# Altium project Solar_Panel_Sides.PrjPcb
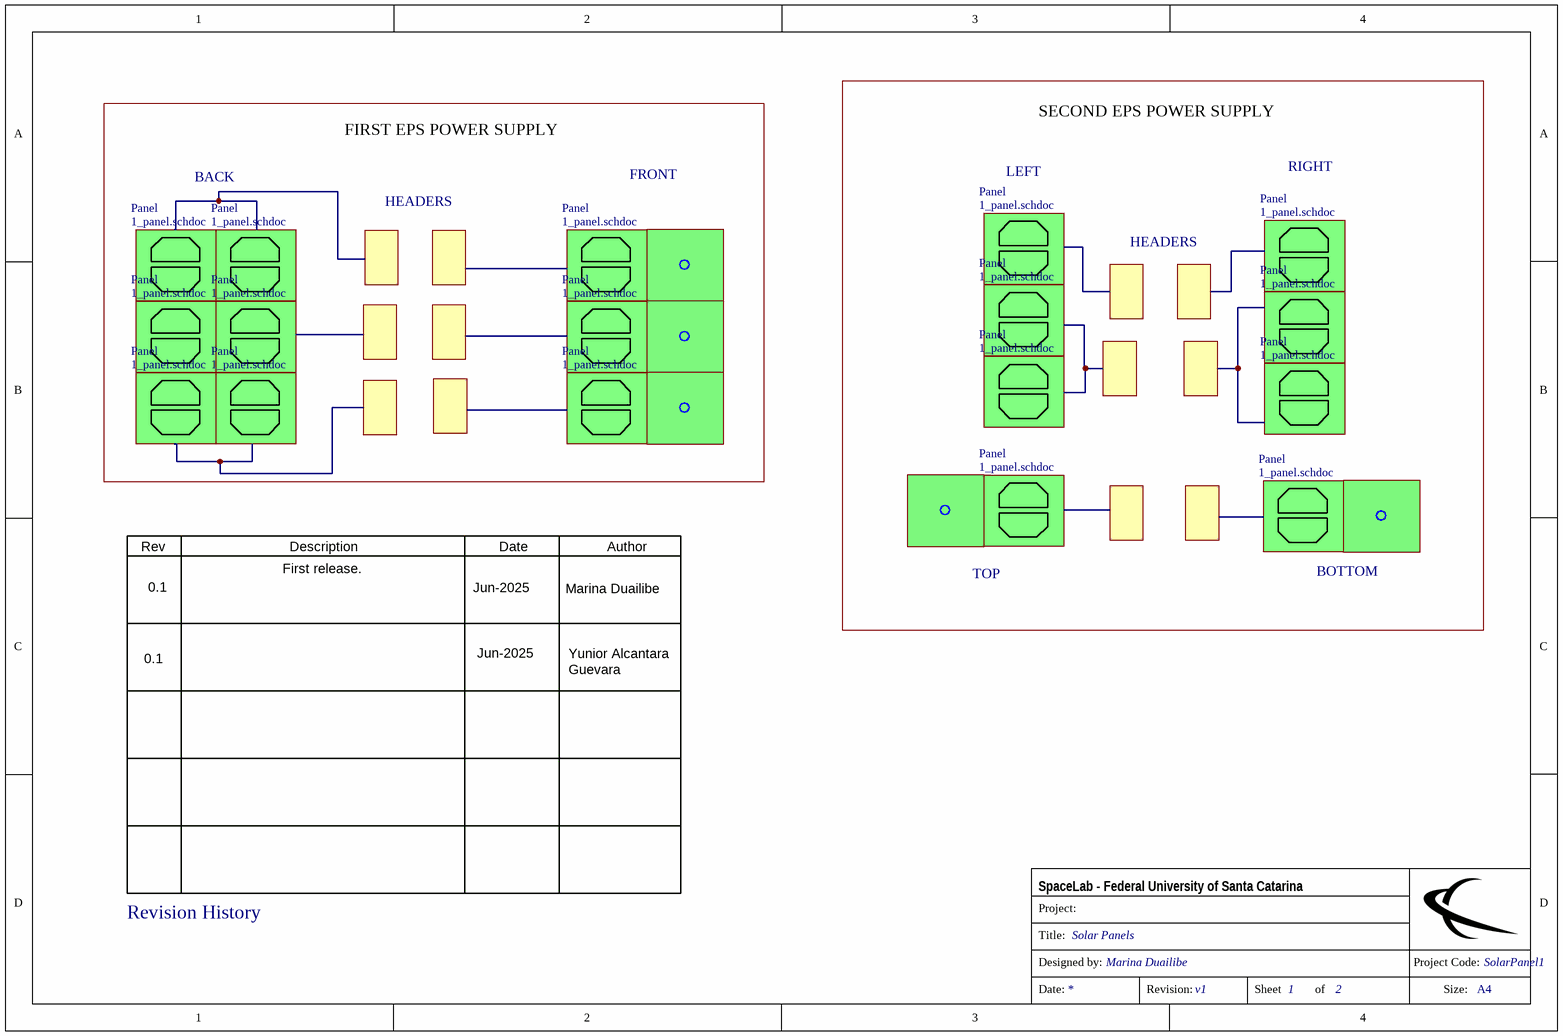
[diagram p0: 1_Architecture.schdoc]
DesignedBy: Marina Duailibe; ProjectCode: SolarPanel1; Revision: v1
2 sheets, 153 parts. Net scope: global (net labels, ports and power ports of the same name join across sheets).
Board file: PCB1.PcbDoc
Sheets:
  1_Architecture.schdoc
    Panel = 1_panel.schdoc
    Panel = 1_panel.schdoc
    Panel = 1_panel.schdoc
    Panel = 1_panel.schdoc
    Panel = 1_panel.schdoc
    Panel = 1_panel.schdoc
    Panel = 1_panel.schdoc
    Panel = 1_panel.schdoc
    Panel = 1_panel.schdoc
    Panel = 1_panel.schdoc
    Panel = 1_panel.schdoc
    Panel = 1_panel.schdoc
    Panel = 1_panel.schdoc
    Panel = 1_panel.schdoc
    Panel = 1_panel.schdoc
    Panel = 1_panel.schdoc
    Panel = 1_panel.schdoc

## Sheet 1_Architecture.schdoc: Solar Panels
size A4; Engineer: Eng_2_ALT; SheetNumber: 1; SheetTotal: 2; Designed by: Marina Duailibe; Version: v0.1; ProjectCode: SolarPanel1

### Sub-sheets
Panel = 1_panel.schdoc: no entries
Panel = 1_panel.schdoc: no entries
Panel = 1_panel.schdoc: no entries
Panel = 1_panel.schdoc: no entries
Panel = 1_panel.schdoc: no entries
Panel = 1_panel.schdoc: no entries
Panel = 1_panel.schdoc: no entries
Panel = 1_panel.schdoc: no entries
Panel = 1_panel.schdoc: no entries
Panel = 1_panel.schdoc: no entries
Panel = 1_panel.schdoc: no entries
Panel = 1_panel.schdoc: no entries
Panel = 1_panel.schdoc: no entries
Panel = 1_panel.schdoc: no entries
Panel = 1_panel.schdoc: no entries
Panel = 1_panel.schdoc: no entries
Panel = 1_panel.schdoc: no entries

### Notes on the sheet
- BACK
- FIRST EPS POWER SUPPLY
- FRONT
- LEFT
- SECOND EPS POWER SUPPLY
- RIGHT
- HEADERS
- Rev
- Description
- Date
- Author
- TOP
- BOTTOM
- 0.1
- First release.
- Jun-2025
- Marina Duailibe
- Yunior Alcantara
- Guevara
- Revision History
- Project:
- SpaceLab - Federal University of Santa Catarina
- Title:
- Designed by:
- Project Code:
- Date:
- Revision:
- Sheet
- of
- Size:
- A4

## Sheet 1_panel.schdoc: Solar Cells
size A4; Engineer: Eng_2_ALT; SheetNumber: 2; SheetTotal: 2; Designed by: Marina Duailibe; Version: v0.1; ProjectCode: SolarPanel1
Used 17 times, as channels Panel, Panel, Panel, Panel, Panel, Panel, Panel, Panel, Panel, Panel, Panel, Panel, Panel, Panel, Panel, Panel, Panel. Parts and nets are listed once, with the designators drawn on the sheet.
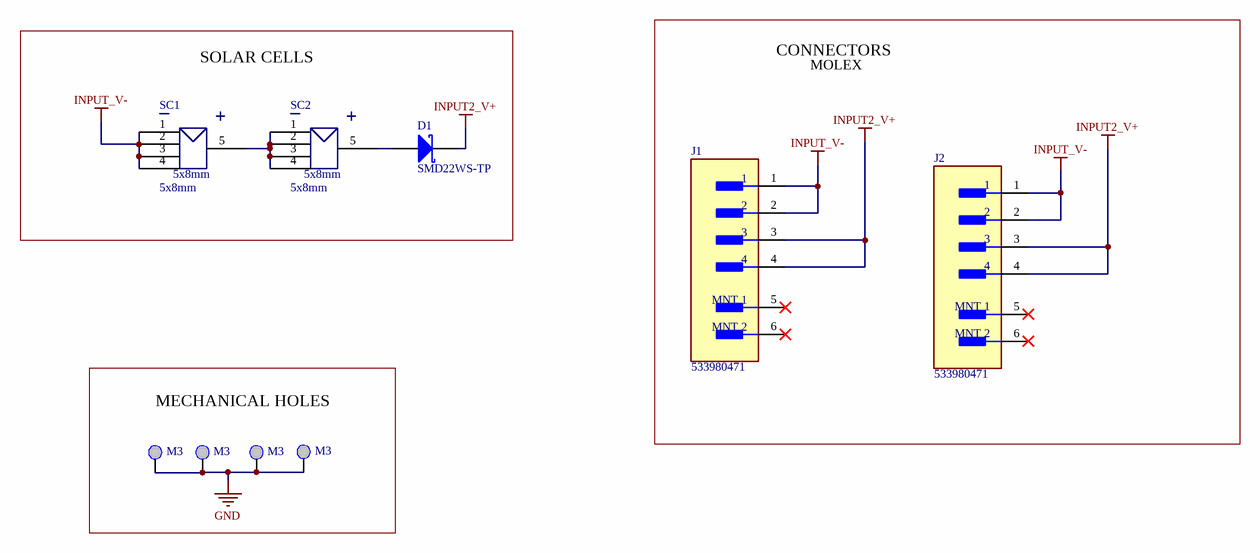
[diagram p1: 1_panel.schdoc]

### Parts
D1  SMD22WS-TP  [SOD323F]
J1  533980471  [FP-533980471-MFG]
J2  533980471  [FP-533980471-MFG]
MEC1  M3  [HOLE6x6mm]  (no BOM)
MEC2  M3  [HOLE6x6mm]  (no BOM)
MEC3  M3  [HOLE6x6mm]  (no BOM)
MEC4  M3  [HOLE6x6mm]  (no BOM)
SC1  5x8mm  [SOLAR_CELL]
SC2  5x8mm  [SOLAR_CELL]

### Blocks framed on the sheet
SOLAR CELLS: D1 SC1 SC2
CONNECTORS: J1 J2
MECHANICAL HOLES: MEC1-MEC4

### Nets
GND: MEC1.0 MEC2.0 MEC3.0 MEC4.0
INPUT2_V+: D1.1(K) J1.3 J1.4 J2.3 J2.4
INPUT_V-: J1.1 J1.2 J2.1 J2.2 SC1.1(V+) SC1.2(V-) SC1.3 SC1.4
NetD1_2: D1.2(A) SC2.5
NetSC1_5: SC1.5 SC2.1(V+) SC2.2(V-) SC2.3 SC2.4

Not connected (* = marked no-connect by the designer): J1 5(MNT_1)* 6(MNT_2)*; J2 5(MNT_1)* 6(MNT_2)*

### Channels
Panel: no parts or ports
Panel: designators end in _Panel#1
Panel: designators end in _Panel#2
Panel: designators end in _Panel#3
Panel: designators end in _Panel#4
Panel: designators end in _Panel#5
Panel: designators end in _Panel#6
Panel: designators end in _Panel#7
Panel: designators end in _Panel#8
Panel: designators end in _Panel#9
Panel: designators end in _Panel#10
Panel: designators end in _Panel#11
Panel: designators end in _Panel#12
Panel: designators end in _Panel#13
Panel: designators end in _Panel#14
Panel: designators end in _Panel#15
Panel: designators end in _Panel#16

### Notes on the sheet
- MOLEX
- Project:
- SpaceLab - Federal University of Santa Catarina
- Title:
- Designed by:
- Project Code:
- Date:
- Revision:
- Sheet
- of
- Size:
- A4
- (in symbol SOLAR CELL) _; +

### Library data of the parts
D1 = DIODE_SCHOTTKY_20V_2A_SMD22WS-TP: Diode Schottky 20 V 2A Surface Mount SOD-323; Partnumber: SMD22WS-TP
J1 J2 = CMP-04776-000105-1: CONN HEADER SMD 4POS 1.25MM; Manufacturer: Molex; Conn Gender: Male; Conn Orientation: Vertical; Standoff Height: 0.05mm; Number Of Contacts: 4; Current Rating: 1A; Voltage Rating: 125V; Package: 0; ComponentLink2Description: Datasheet; ComponentLink2URL: https://www.molex.com/pdm_docs/ps/PS-51021-024-001.pdf; Ambient Temperature Range Low: -40°C; Category: Conn; Automotive: No; Number Of Rows: 1; Device Class L3: unset; Ambient Temperature Range High: +105°C; Height: 5.1mm; Lead Free: Yes; Pitch: 1.25mm; Contact Material: Tin; Footprint Url: https://www.molex.com/pdm_docs/sd/533980471_sd.pdf; Octopart: https://octopart.com/53398-0471-molex-655296; Temperature Range Low: -40°C; Device Class L2: Headers and Wire Housings; Temperature: -40°C to +105°C; Digikey Description: CONN HEADER SMD 4POS 1.25MM; RoHS: TRUE; Manufacturer Part Number: 533980471; Device Class L1: Connectors; Temperature Range High: +105°C
MEC1-MEC4 = M3 hole
SC1 SC2 = SOLAR CELL: Manufacturer: Yim Space; PDM Number: SC-3GA-3

## Nets that join several sheets
GND: Panel (MEC1.0 MEC2.0 MEC3.0 MEC4.0), Panel (MEC1_Panel#1.0 MEC2_Panel#1.0 MEC3_Panel#1.0 MEC4_Panel#1.0), Panel (MEC1_Panel#2.0 MEC2_Panel#2.0 MEC3_Panel#2.0 MEC4_Panel#2.0), Panel (MEC1_Panel#3.0 MEC2_Panel#3.0 MEC3_Panel#3.0 MEC4_Panel#3.0), Panel (MEC1_Panel#4.0 MEC2_Panel#4.0 MEC3_Panel#4.0 MEC4_Panel#4.0), Panel (MEC1_Panel#5.0 MEC2_Panel#5.0 MEC3_Panel#5.0 MEC4_Panel#5.0), Panel (MEC1_Panel#6.0 MEC2_Panel#6.0 MEC3_Panel#6.0 MEC4_Panel#6.0), Panel (MEC1_Panel#7.0 MEC2_Panel#7.0 MEC3_Panel#7.0 MEC4_Panel#7.0), Panel (MEC1_Panel#8.0 MEC2_Panel#8.0 MEC3_Panel#8.0 MEC4_Panel#8.0), Panel (MEC1_Panel#9.0 MEC2_Panel#9.0 MEC3_Panel#9.0 MEC4_Panel#9.0), Panel (MEC1_Panel#10.0 MEC2_Panel#10.0 MEC3_Panel#10.0 MEC4_Panel#10.0), Panel (MEC1_Panel#11.0 MEC2_Panel#11.0 MEC3_Panel#11.0 MEC4_Panel#11.0), Panel (MEC1_Panel#12.0 MEC2_Panel#12.0 MEC3_Panel#12.0 MEC4_Panel#12.0), Panel (MEC1_Panel#13.0 MEC2_Panel#13.0 MEC3_Panel#13.0 MEC4_Panel#13.0), Panel (MEC1_Panel#14.0 MEC2_Panel#14.0 MEC3_Panel#14.0 MEC4_Panel#14.0), Panel (MEC1_Panel#15.0 MEC2_Panel#15.0 MEC3_Panel#15.0 MEC4_Panel#15.0), Panel (MEC1_Panel#16.0 MEC2_Panel#16.0 MEC3_Panel#16.0 MEC4_Panel#16.0)
INPUT2_V+: Panel (5 pins), Panel (5 pins), Panel (5 pins), Panel (5 pins), Panel (5 pins), Panel (5 pins), Panel (5 pins), Panel (5 pins), Panel (5 pins), Panel (5 pins), Panel (5 pins), Panel (5 pins), Panel (5 pins), Panel (5 pins), Panel (5 pins), Panel (5 pins), Panel (5 pins)
INPUT_V-: Panel (8 pins), Panel (8 pins), Panel (8 pins), Panel (8 pins), Panel (8 pins), Panel (8 pins), Panel (8 pins), Panel (8 pins), Panel (8 pins), Panel (8 pins), Panel (8 pins), Panel (8 pins), Panel (8 pins), Panel (8 pins), Panel (8 pins), Panel (8 pins), Panel (8 pins)